# Altium schematic sheet Schematic.SchDoc: Touch Sensitive Heart Keychain
size A4; PageSetup: Record=PageOptions|CenterHorizontal=True|CenterVertical=True|PrintScale=1.09|XCorrection=1.00|YCorrection=1.00|PrintKind=0|BorderSize=5000000|LeftOffset=0|BottomOffset=0|Orientation=2|PaperLength=1000|PaperWidth=1000|Scale=100|PaperSource=7|PrintQuality=-3|MediaType=1|DitherType=10|PrintScaleMode=1|PaperKind=A4|PaperIndex=9; URL: http://sasakaranovic.com/projects/diy-heart-keychain/
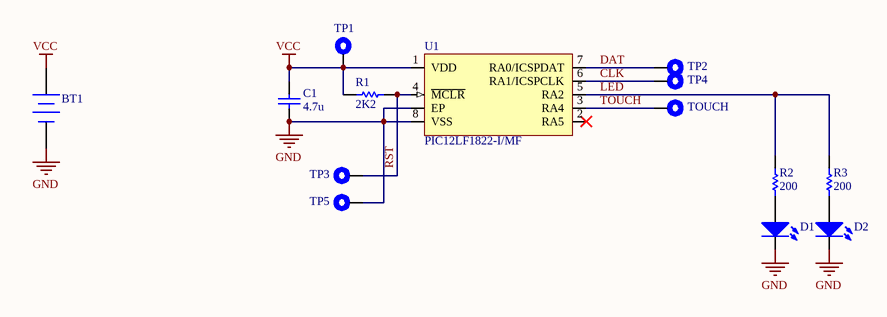
[diagram p0: Schematic.SchDoc]

## Parts
BT1  Battery  [CR2032 SMD]  (value not drawn)
C1  value 4.7u  [0603 - CAP]  (hidden comment: Cap)
D1  LED  [0805 -  LED]  (value not drawn)
D2  LED  [0805 -  LED]  (value not drawn)
R1  value 2K2  [0603]  (hidden comment: Res)
R2  value 200  [0603]  (hidden comment: Res)
R3  value 200  [0603]  (hidden comment: Res)
TOUCH  Test Point  [TestPoint_TH]  (value not drawn)
TP1  Test Point  [TP_SMD_1mm]  (value not drawn)
TP2  Test Point  [TP_SMD_1mm]  (value not drawn)
TP3  Test Point  [TP_SMD_1mm]  (value not drawn)
TP4  Test Point  [TP_SMD_1mm]  (value not drawn)
TP5  Test Point  [TP_SMD_1mm]  (value not drawn)
U1  PIC12LF1822-I/MF  [PIC12LF1822-I/MF]

## Nets
GND: BT1.2(-) C1.1 D1.K D2.K TP5.1 U1.8(VSS) U1.EP
VCC: BT1.1(+) C1.2 R1.1 TP1.1 U1.1(VDD)
CLK: TP4.1 U1.6(RA1/ICSPCLK)
DAT: TP2.1 U1.7(RA0/ICSPDAT)
LED: R2.2 R3.2 U1.5(RA2)
RST: R1.2 TP3.1 U1.4(~{MCLR})
TOUCH: TOUCH.1 U1.3(RA4)
NetD1_A: D1.A R2.1
NetD2_A: D2.A R3.1

Not connected (* = marked no-connect by the designer): U1 2(RA5)*

## Notes on the sheet
- sasakaranovic.com/youtube
- sasakaranovic.com
- sasakaranovic.com/github
- sasakaranovic.com/facebook
- sasakaranovic.com/twitter
- sasakaranovic.com/linkedin

## Library data of the parts
BT1 = Battery: Multicell Battery; Published: 24-Mar-1999; LatestRevisionDate: 17-Jul-2002; LatestRevisionNote: Re-released for DXP Platform.; PackageReference: BAT-2; Publisher: Altium Limited; PackageDescription: Battery; 2 Leads; Distributor: Digikey; Distributor PN: BAT-HLD-002-SMT-ND
C1 = Cap: Capacitor; Published: 8-Jun-2000; LatestRevisionDate: 17-Jul-2002; LatestRevisionNote: Re-released for DXP Platform.; PackageReference: RAD-0.3; Publisher: Altium Limited; PackageDescription: Radial Cap, Thru-Hole; 2 Leads; 0.3 in Pin Spacing; Distributor: Digikey; Distributor PN: 1276-2087-1-ND
D1 D2 = LED: Typical RED GaAs LED; Published: 8-Jun-2000; LatestRevisionDate: 08-Jul-2005; LatestRevisionNote: Mech Layer 1 removed.; PackageReference: LED-1; Publisher: Altium Limited; PackageDescription: LED; 2 Leads; Supplier 1: Digi-Key; Distributor: Digikey; Distributor PN: 475-1278-1-ND
  D1: Supplier Part Number 2: 475-1278-1-ND
  D2: Supplier Part Number 1: 475-1278-1-ND
R1-R3 = Res: Resistor; Published: 8-Jun-2000; LatestRevisionDate: 17-Jul-2002; LatestRevisionNote: Re-released for DXP Platform.; PackageReference: AXIAL-0.3; Publisher: Altium Limited; PackageDescription: Axial Device, Thru-Hole; 2 Leads; 0.3 in Pin Spacing; Distributor: Digikey
  R1: Distributor PN: 311-2.20KHRCT-ND
  R2 R3: Supplier 1: Digi-Key; Supplier Part Number 1: 311-200HRTR-ND; Distributor PN: 311-200HRTR-ND
U1 = PIC12LF1822-I/MF: Manufacturer: Microchip Technology; Distributor: Digikey; Distributor PN: PIC12LF1822-I/MF-ND; Manufacturer PN: PIC12LF1822-I/MF